# Altium schematic sheet HAL_4.SchDoc
size A
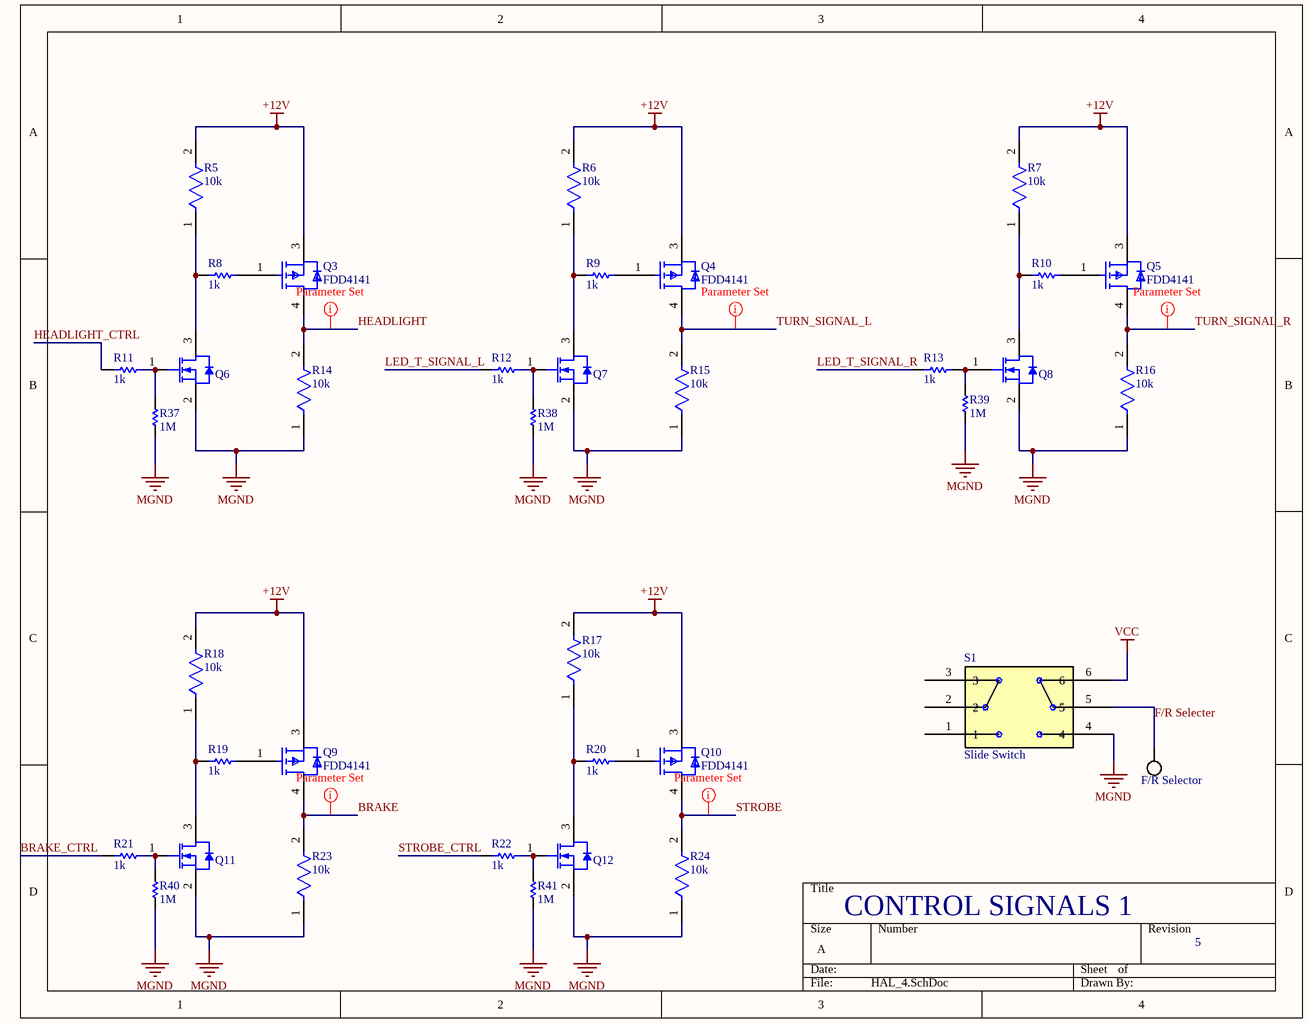
[diagram p0: HAL_4.SchDoc]

## Parts
F/R_Selector  F/R Selector  [EPAD]  (value not drawn)  (no BOM)
Q3  FDD4141  [FP-369AS-MFG]
Q4  FDD4141  [FP-369AS-MFG]
Q5  FDD4141  [FP-369AS-MFG]
Q6  NTR4501NT1G  [ONSC-SOT-23-3-318-08_V]  (value not drawn)
Q7  NTR4501NT1G  [ONSC-SOT-23-3-318-08_V]  (value not drawn)
Q8  NTR4501NT1G  [ONSC-SOT-23-3-318-08_V]  (value not drawn)
Q9  FDD4141  [FP-369AS-MFG]
Q10  FDD4141  [FP-369AS-MFG]
Q11  NTR4501NT1G  [ONSC-SOT-23-3-318-08_V]  (value not drawn)
Q12  NTR4501NT1G  [ONSC-SOT-23-3-318-08_V]  (value not drawn)
R5  10k  [FP-RMCF0805-MFG]
R6  10k  [FP-RMCF0805-MFG]
R7  10k  [FP-RMCF0805-MFG]
R8  1k  [RESC3216X70X40LL20T20]
R9  1k  [RESC3216X70X40LL20T20]
R10  1k  [RESC3216X70X40LL20T20]
R11  1k  [RESC3216X70X40LL20T20]
R12  1k  [RESC3216X70X40LL20T20]
R13  1k  [RESC3216X70X40LL20T20]
R14  10k  [FP-RMCF0805-MFG]
R15  10k  [FP-RMCF0805-MFG]
R16  10k  [FP-RMCF0805-MFG]
R17  10k  [FP-RMCF0805-MFG]
R18  10k  [FP-RMCF0805-MFG]
R19  1k  [RESC3216X70X40LL20T20]
R20  1k  [RESC3216X70X40LL20T20]
R21  1k  [RESC3216X70X40LL20T20]
R22  1k  [RESC3216X70X40LL20T20]
R23  10k  [FP-RMCF0805-MFG]
R24  10k  [FP-RMCF0805-MFG]
R37  value 1M  [0603_B]  (hidden comment: CRCW06031M00FKEA)
R38  value 1M  [0603_B]  (hidden comment: CRCW06031M00FKEA)
R39  value 1M  [0603_B]  (hidden comment: CRCW06031M00FKEA)
R40  value 1M  [0603_B]  (hidden comment: CRCW06031M00FKEA)
R41  value 1M  [0603_B]  (hidden comment: CRCW06031M00FKEA)
S1  Slide Switch  [DPDT Switch]

## Nets
+12V: Q3.3(S) Q4.3(S) Q5.3(S) Q9.3(S) Q10.3(S) R5.2 R6.2 R7.2 R17.2 R18.2
MGND: Q6.2(S) Q7.2(S) Q8.2(S) Q11.2(S) Q12.2(S) R14.1 R15.1 R16.1 R23.1 R24.1 R37.1 R38.1 R39.1 R40.1 R41.1 S1.4
VCC: S1.6
BRAKE: Q9.4(D) R23.2
BRAKE_CTRL: R21.1
F/R Selecter: F/R_Selector.1 S1.5
HEADLIGHT: Q3.4(D) R14.2
HEADLIGHT_CTRL: R11.1
LED_T_SIGNAL_L: R12.1
LED_T_SIGNAL_R: R13.1
STROBE: Q10.4(D) R24.2
STROBE_CTRL: R22.1
TURN_SIGNAL_L: Q4.4(D) R15.2
TURN_SIGNAL_R: Q5.4(D) R16.2
NetQ3_1: Q3.1(G) R8.2
NetQ4_1: Q4.1(G) R9.2
NetQ5_1: Q5.1(G) R10.2
NetQ6_1: Q6.1(G) R11.2 R37.2
NetQ6_3: Q6.3(D) R5.1 R8.1
NetQ7_1: Q7.1(G) R12.2 R38.2
NetQ7_3: Q7.3(D) R6.1 R9.1
NetQ8_1: Q8.1(G) R13.2 R39.2
NetQ8_3: Q8.3(D) R7.1 R10.1
NetQ9_1: Q9.1(G) R19.2
NetQ10_1: Q10.1(G) R20.2
NetQ11_1: Q11.1(G) R21.2 R40.2
NetQ11_3: Q11.3(D) R18.1 R19.1
NetQ12_1: Q12.1(G) R22.2 R41.2
NetQ12_3: Q12.3(D) R17.1 R20.1

Not connected (* = marked no-connect by the designer): S1 1 2 3

## Layout directives
rule Width Constraint [Pref Width = 70mil    Min Width = 70mil    Max Width = 70mil]: BRAKE, HEADLIGHT, STROBE, TURN_SIGNAL_L, TURN_SIGNAL_R

## Notes on the sheet
- CONTROL SIGNALS 1
- 5

## Library data of the parts
F/R_Selector = EPAD: Pad for probing signals
Q3-Q5 Q9 Q10 = CMP-07173-000088-1: MOSFET P-CH 40V 10.8A DPAK; Manufacturer: ON Semiconductor; Gate Charge At Vgs: 36nC @ -10V; Transconductance: 38S; Drain To Source Breakdown Voltage: -40V; Reverse Recovery Time: 29ns; Pulse Drain Current: -100A; Reverse Recovery Charge: 26nC; Drain To Source Resistance: 10.1mΩ; Power Dissipation: 2.4W; Max Forward Diode Voltage: -1.2V; Turn Off Delay Time: 38ns; Number Of P Channels: 1; Gate To Source Voltage: 20V; Rthja Max: 52°C/W; Depletion Mode: False; Threshold Vgs Max: -3V; Threshold Vgs Min: -1V; Turn On Delay Time: 10ns; Max Junction Temp: +150°C; Input Capacitace At Vds: 2085pF @ -20V; Continuous Drain Current: -10.8A; Typ Forward Diode Voltage: -0.8V; Package: 369AS; Category: Diode; RoHS: TRUE; Device Class L2: Transistors; Octopart: https://octopart.com/fdd4141-on+semiconductor-84325802; Temperature: -55°C to +150°C; Drain To Source Voltage: -40V; Device Class L1: Discrete Semiconductors; Temperature Range Low: -55°C; Height: 2.517mm; ComponentLink2Description: Datasheet; Automotive: No; Number Of Channels: 1; Digikey Description: MOSFET P-CH 40V 10.8A DPAK; Lead Free: Yes; Manufacturer Part Number: FDD4141; Temperature Range High: +150°C; Footprint Url: https://www.onsemi.com/pub/Collateral/369AS.PDF; Device Class L3: MOSFETs; Mouser Description: MOSFET -40V P-Channel PowerTrench; ComponentLink2URL: https://www.onsemi.com/pub/Collateral/FDD4141-D.pdf
Q6-Q8 Q11 Q12 = CMP-1058-00732-1: Power MOSFET, 20 V, 3.2 A, Single N-Channel, 3-Pin SOT-23, Pb-Free, Tape and Reel; Manufacturer: On Semiconductor; Crss Typ (pF): 50; Ciss Typ (pF): 200; VGS(th) Max (V): 1.2; Coss Typ (pF): 80; PD Max (W): 1.25; VGS Max (V): 12; V(BR)DSS Min (V): 20; Channel Polarity: N Channel; Qrr Typ (nC): 3; PackageReference: SOT-23-3-318-08; ComponentLink2Description: Datasheet; PackageVersion: Rev. AP, 11/2009; ComponentLink1URL: http://www.onsemi.com/; RoHS: Pb-Free; Mounting Technology: Surface Mount; Package Type: SOT-23-3; ComponentLink1Description: Manufacturer URL; PackageDescription: 3-Pin Small Outline Transistor, Body 2.92 x 1.3 mm, Pitch 0.95 mm; Packing: Tape and Reel; PartNumber: NTR4501NT1G; DatasheetVersion: Rev. 13; ComponentLink2URL: http://www.onsemi.cn/pub_link/Collateral/NTR4501N-D.PDF; Configuration: Single; ComponentLink3URL: http://www.onsemi.cn/pub_link/Collateral/318-08.PDF; ComponentLink3Description: Package Specification
R5-R7 R14-R18 R23 R24 = CMP-26527-000121-1: RES 10K OHM 1% 1/8W 0805; Power Rating: 125mW; Resistance: 10kR; Temperature Coefficient: 100ppm/°C; Depth: 1.25mm; Construction: Rectangular; Packaging: Tape and Reel; Tolerance: 1%; Lead Free: Lead Free; Case/Package: 0805; RoHS Compliant: Yes; Series: RMCF; Width: 0.049inch; Max Power Dissipation: 125mW; Contact Plating: Tin; Height: 0.026inch; Mount: Surface Mount; Resistor Type: Thick Film; Size Code: 0805; Length: 2mm; Max Operating Temperature: 155°C; Features: Automotive AEC-Q200; Radiation Hardening: No; Case Code (Imperial): 0805; Min Operating Temperature: -55°C; Case Code (Metric): 2012; Number of Terminations: 2; Military Standard: Not
R8-R13 R19-R22 = CMP-2003-04517-1: RK73B2BTTD102J; Manufacturer: KOA Speer; Part Number: RK73B2BTTD102J
R37-R41 = CRCW06031M00FKEA: 0603 1MOhm resistor; ComponentLink1URL: http://www.vishay.com/doc?20035; ComponentLink1Description: datasheet; supplier1: http://search.digikey.com/scripts/DkSearch/dksus.dll?Detail&name=541-1.00MHCT-ND